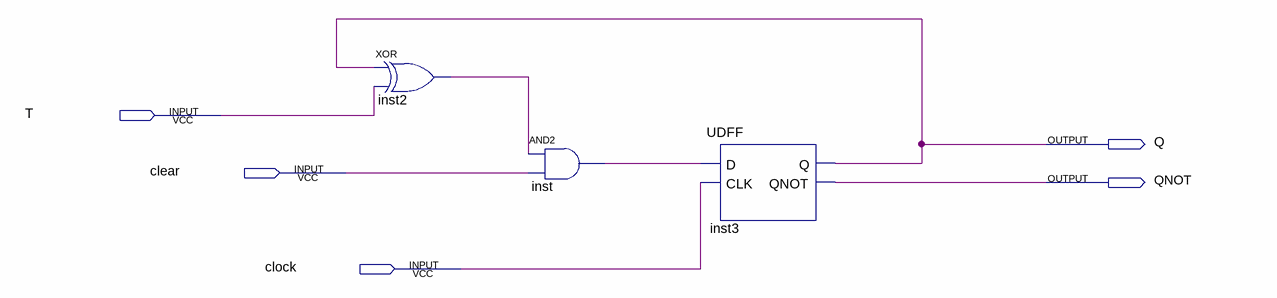
[diagram p0: schematic sheet]
// Quartus schematic OTFF.bdf as structural Verilog: 3 symbols, 5 pins
module OTFF (
  input  T,
  input  clear,
  input  clock,
  output Q,
  output QNOT
);

  wire inst2_out, inst_out;

  xor inst2 (inst2_out, Q, T);
  and inst (inst_out, inst2_out, clear);
  UDFF inst3 (.D(inst_out), .CLK(clock), .Q(Q), .QNOT(QNOT));
endmodule
